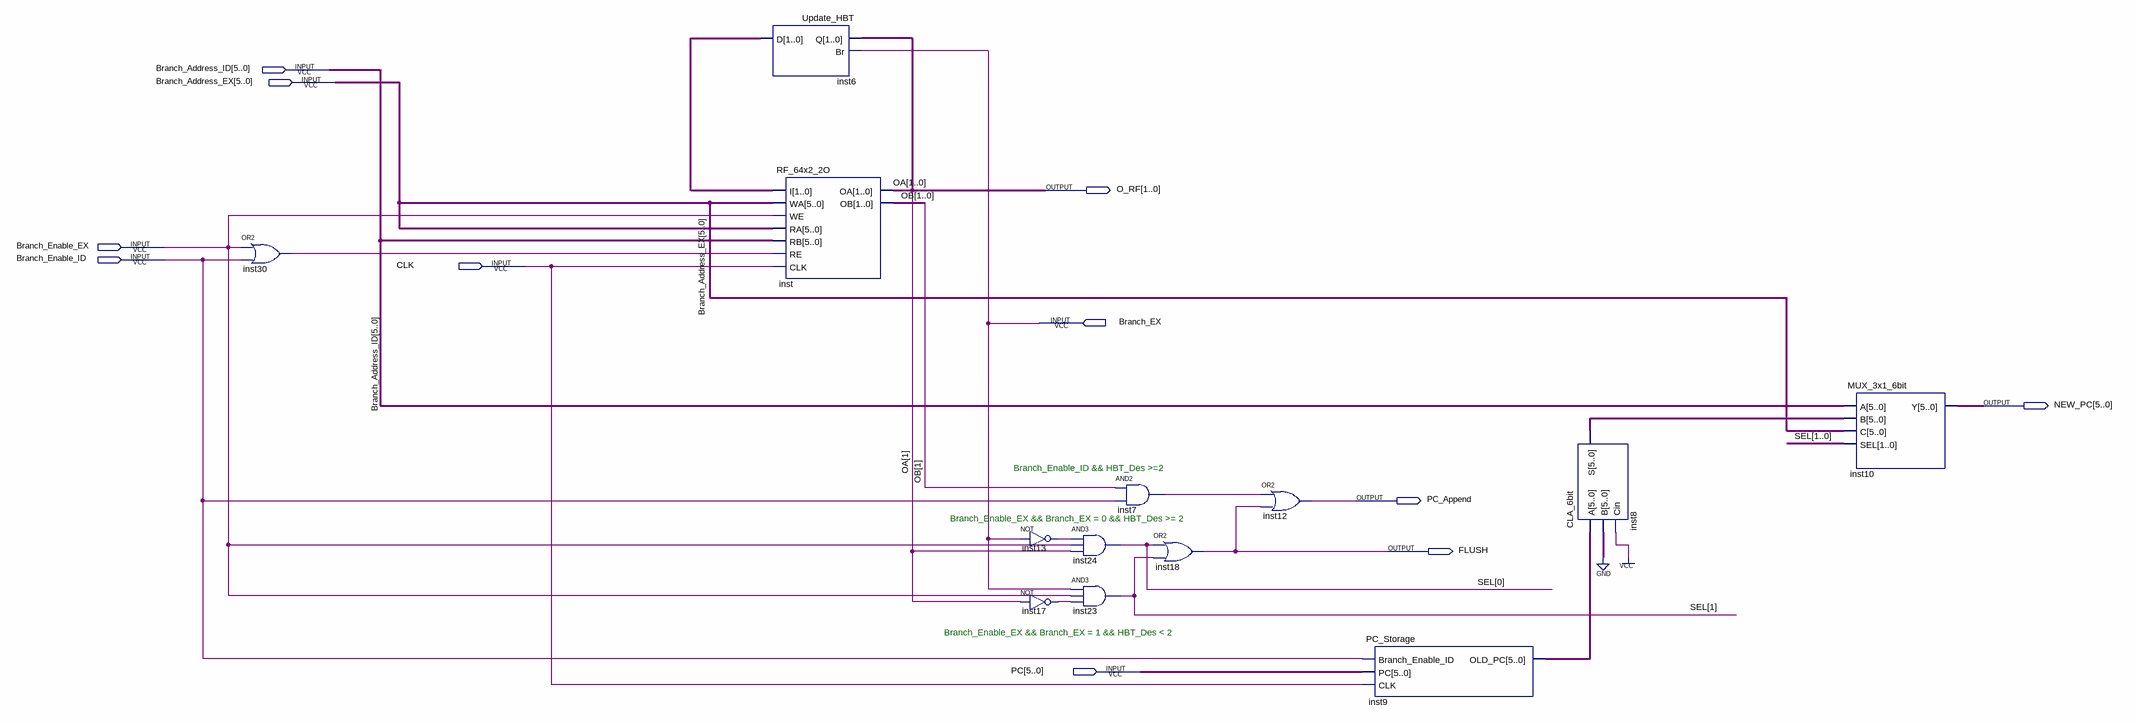
[diagram p0: schematic sheet]
// Quartus schematic BranchPrediction.bdf as structural Verilog: 13 symbols, 11 pins
module BranchPrediction (
  input  [5:0] Branch_Address_ID,
  input  [5:0] Branch_Address_EX,
  input  Branch_Enable_EX,
  input  Branch_Enable_ID,
  input  CLK,
  input  Branch_EX,
  input  [5:0] PC,
  output [1:0] O_RF,
  output [5:0] NEW_PC,
  output PC_Append,
  output FLUSH
);

  wire inst7_out, inst13_out, inst17_out, inst30_out;
  wire [1:0] inst6_d, OB, SEL;
  wire [5:0] inst8_s, inst9_old_pc;

  or inst30 (inst30_out, Branch_Enable_EX, Branch_Enable_ID);
  Update_HBT inst6 (.Q(O_RF), .Br(Branch_EX), .D(inst6_d));
  RF_64x2_2O inst (
    .I(inst6_d), .WA(Branch_Address_EX), .WE(Branch_Enable_EX), .RA(Branch_Address_EX),
    .RB(Branch_Address_ID), .RE(inst30_out), .CLK(CLK), .OA(O_RF), .OB(OB));
  not inst13 (inst13_out, Branch_EX);
  not inst17 (inst17_out, O_RF[1]);
  and inst24 (SEL[0], inst13_out, Branch_Enable_EX, O_RF[1]);
  and inst23 (SEL[1], Branch_EX, Branch_Enable_EX, inst17_out);
  and inst7 (inst7_out, OB[1], Branch_Enable_ID);
  or inst18 (FLUSH, SEL[0], SEL[1]);
  or inst12 (PC_Append, inst7_out, FLUSH);
  PC_Storage inst9 (.Branch_Enable_ID(Branch_Enable_ID), .PC(PC), .CLK(CLK), .OLD_PC(inst9_old_pc));
  CLA_6bit inst8 (.A(inst9_old_pc), .B({6{1'b0}}), .Cin(1'b1), .S(inst8_s));
  MUX_3x1_6bit inst10 (.A(Branch_Address_ID), .B(inst8_s), .C(Branch_Address_EX), .SEL(SEL), .Y(NEW_PC));

  // Other names for the same wires on the sheet: OA[1:0] = O_RF

  // Notes on the sheet:
  //   Branch_Enable_ID && HBT_Des >=2 
  //   Branch_Enable_EX && Branch_EX = 0 && HBT_Des >= 2
  //   Branch_Enable_EX && Branch_EX = 1 && HBT_Des < 2
endmodule
